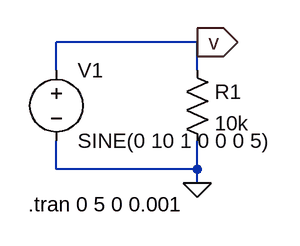
[diagram p0: schematic g2_p1.asc]
g2_p1.asc, the LTspice schematic file:
Version 4
SHEET 1 880 680
WIRE 304 112 144 112
WIRE 144 144 144 112
WIRE 304 144 304 112
WIRE 144 256 144 224
WIRE 304 256 304 224
WIRE 304 256 144 256
WIRE 304 272 304 256
FLAG 304 272 0
FLAG 304 112 v
IOPIN 304 112 Out
SYMBOL voltage 144 128 R0
WINDOW 123 0 0 Left 0
WINDOW 39 0 0 Left 0
SYMATTR InstName V1
SYMATTR Value SINE(0 10 1 0 0 0 5)
SYMBOL res 288 128 R0
SYMATTR InstName R1
SYMATTR Value 10k
TEXT 112 296 Left 2 !.tran 0 5 0 0.001

The netlist it stands for:
* g2_p1.asc
V1 v 0 SINE(0 10 1 0 0 0 5)
R1 v 0 10k
.tran 0 5 0 0.001
.backanno
.end